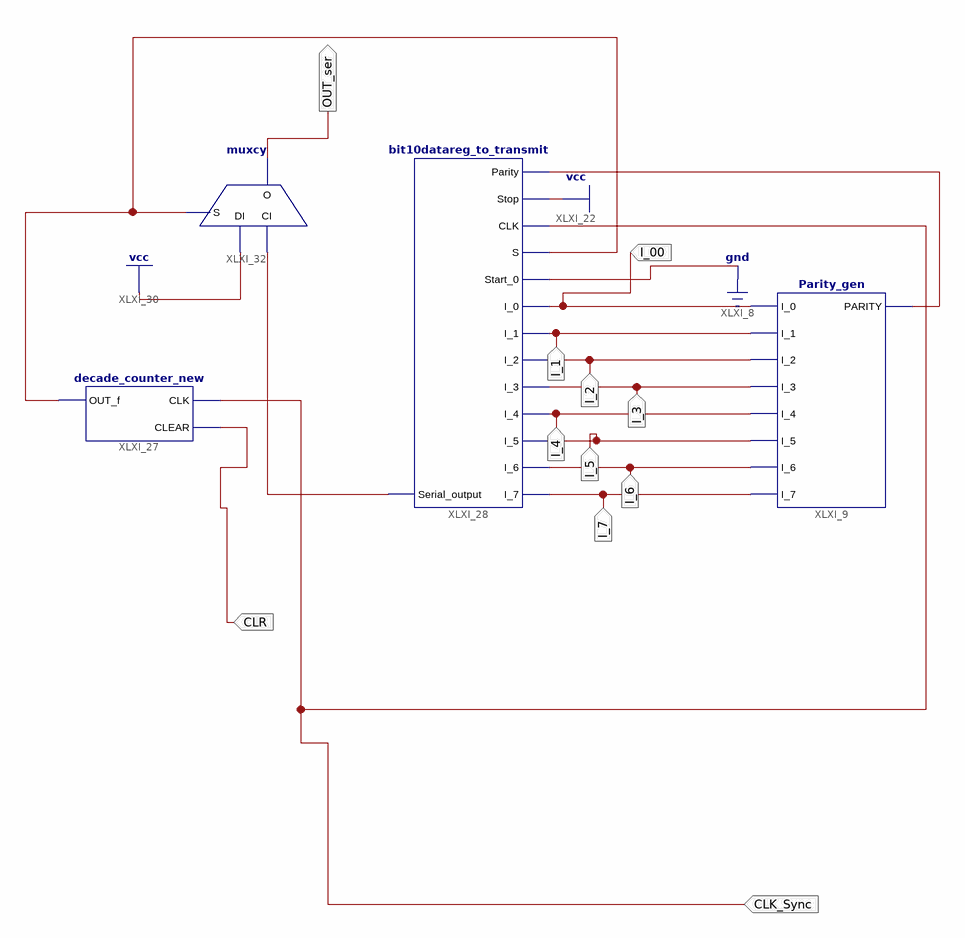
[diagram p0: schematic sheet 1]
// Xilinx ISE schematic usart_transmiter.sch (spartan3e) as structural Verilog: 4 symbols, 11 ports
module usart_transmiter (
  input  I_1,
  input  I_2,
  input  I_6,
  input  I_7,
  input  CLR,
  input  I_3,
  input  I_5,
  input  I_4,
  input  I_00,
  input  CLK_Sync,
  output OUT_ser
);

  wire decade_output, XLXN_42, XLXN_77;

  decade_counter_new XLXI_27 (.CLK(CLK_Sync), .CLEAR(CLR), .OUT_f(decade_output));
  bit10datareg_to_transmit XLXI_28 (
    .I_7(I_7), .I_6(I_6), .I_5(I_5), .I_4(I_4), .I_3(I_3), .I_2(I_2), .I_1(I_1), .I_0(I_00), .Start_0(1'b0),
    .S(decade_output), .CLK(CLK_Sync), .Stop(1'b1), .Parity(XLXN_42), .Serial_output(XLXN_77));
  Parity_gen XLXI_9 (
    .I_0(I_00), .I_1(I_1), .I_2(I_2), .I_3(I_3), .I_4(I_4), .I_5(I_5), .I_6(I_6), .I_7(I_7), .PARITY(XLXN_42));
  muxcy XLXI_32 (.CI(XLXN_77), .DI(1'b1), .S(decade_output), .O(OUT_ser));
endmodule
